# EAGLE design 0606_RGB_Clock_test (EAGLE 5.11)

## Sheet 1 of 3
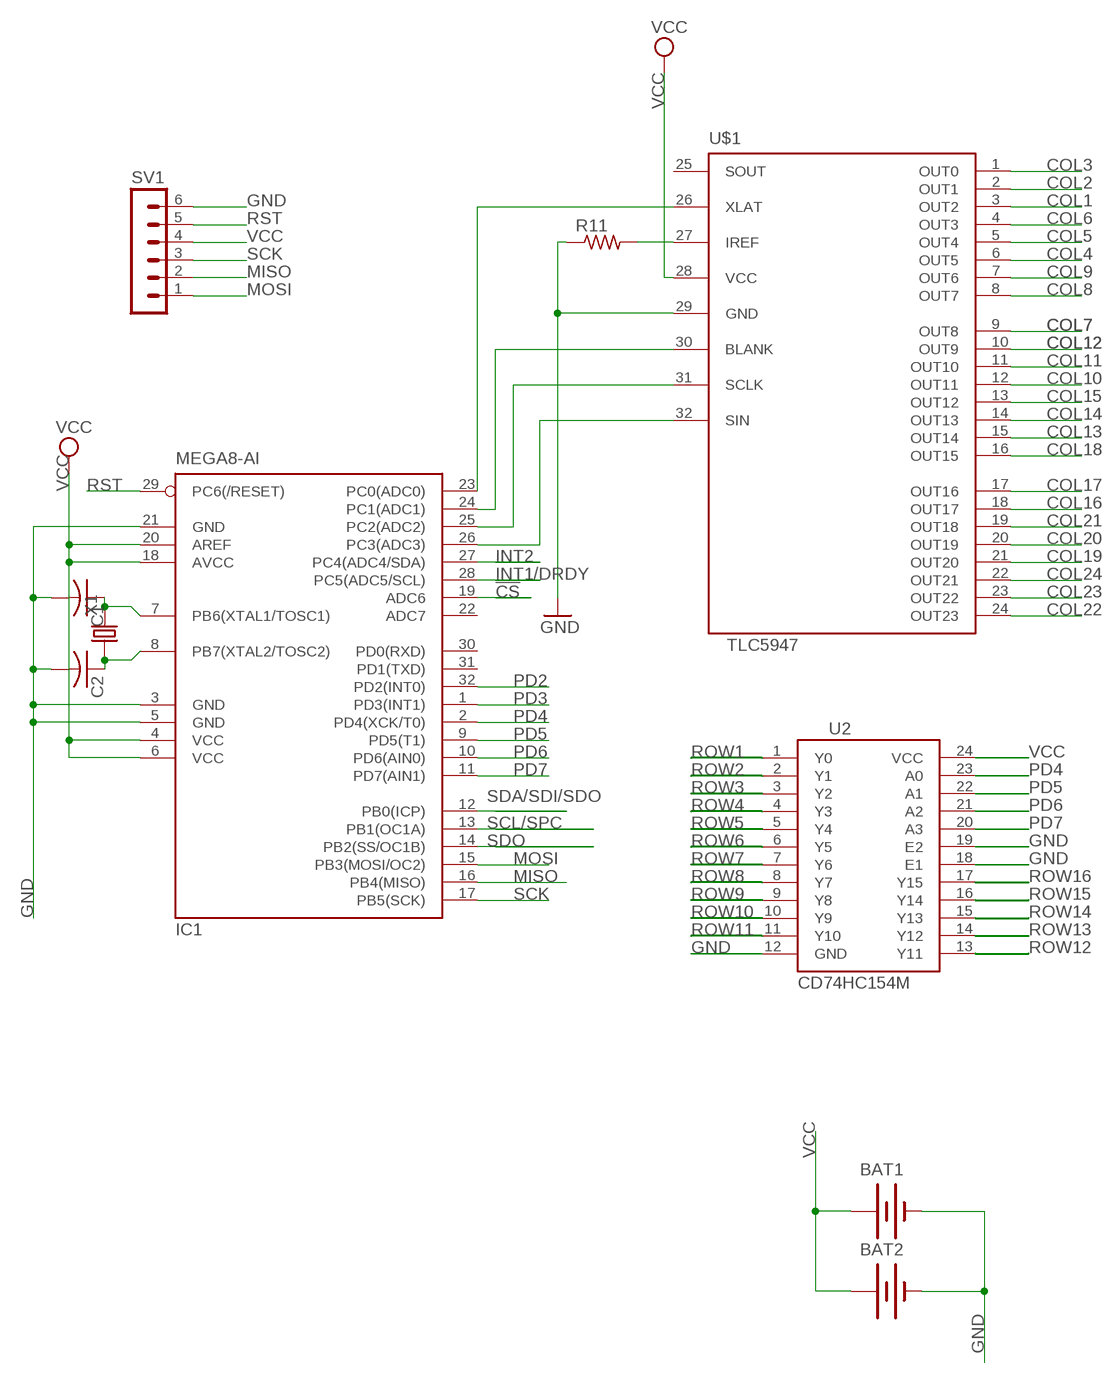
[diagram p0: schematic, sheet 1]

### Parts
BAT1  BATTERY20SMD  [BATTCON_20MM]
BAT2  BATTERY20SMD  [BATTCON_20MM]
C1  C-USC0805  [C0805]
C2  C-USC0805  [C0805]
IC1  MEGA8-AI  [TQFP32-08]
R11  R-US_R0805  [R0805]
SV1  MA06-1  [MA06-1]
U2  CD74HC154M  [SO-24DW]
U$1  TLC5947  [QFN32]
X1  CRYSTAL-5032  [5032]

### Nets
!CS: IC1.19(ADC6) ; also sheet 3
COL1: U$1.3(OUT2) ; also sheet 2
COL2: U$1.2(OUT1) ; also sheet 2
COL3: U$1.1(OUT0) ; also sheet 2
COL4: U$1.6(OUT5) ; also sheet 2
COL5: U$1.5(OUT4) ; also sheet 2
COL6: U$1.4(OUT3) ; also sheet 2
COL7: U$1.9(OUT8) ; also sheet 2
COL8: U$1.8(OUT7) ; also sheet 2
COL9: U$1.7(OUT6) ; also sheet 2
COL10: U$1.12(OUT11) ; also sheet 2
COL11: U$1.11(OUT10) ; also sheet 2
COL12: U$1.10(OUT9) ; also sheet 2
COL13: U$1.15(OUT14) ; also sheet 2
COL14: U$1.14(OUT13) ; also sheet 2
COL15: U$1.13(OUT12) ; also sheet 2
COL16: U$1.18(OUT17) ; also sheet 2
COL17: U$1.17(OUT16) ; also sheet 2
COL18: U$1.16(OUT15) ; also sheet 2
COL19: U$1.21(OUT20) ; also sheet 2
COL20: U$1.20(OUT19) ; also sheet 2
COL21: U$1.19(OUT18) ; also sheet 2
COL22: U$1.24(OUT23) ; also sheet 2
COL23: U$1.23(OUT22) ; also sheet 2
COL24: U$1.22(OUT21) ; also sheet 2
GND: BAT1.2(-) BAT2.2(-) C1.2 C2.2 IC1.3(GND) IC1.5(GND) IC1.21(GND) R11.1 SV1.6 U2.12(GND) U2.18(E1) U2.19(E2) U$1.29(GND) ; also sheet 3
INT1/DRDY: IC1.28(PC5(ADC5/SCL)) ; also sheet 3
INT2: IC1.27(PC4(ADC4/SDA)) ; also sheet 3
MISO: IC1.16(PB4(MISO)) SV1.2
MOSI: IC1.15(PB3(MOSI/OC2)) SV1.1
N$7: C1.1 IC1.7(PB6(XTAL1/TOSC1)) X1.2
N$8: C2.1 IC1.8(PB7(XTAL2/TOSC2)) X1.1
N$9: IC1.23(PC0(ADC0)) U$1.26(XLAT)
N$10: IC1.24(PC1(ADC1)) U$1.30(BLANK)
N$11: IC1.25(PC2(ADC2)) U$1.31(SCLK)
N$12: IC1.26(PC3(ADC3)) U$1.32(SIN)
N$13: R11.2 U$1.27(IREF)
PD2: IC1.32(PD2(INT0)) ; also sheet 3
PD3: IC1.1(PD3(INT1)) ; also sheet 3
PD4: IC1.2(PD4(XCK/T0)) U2.23(A0)
PD5: IC1.9(PD5(T1)) U2.22(A1)
PD6: IC1.10(PD6(AIN0)) U2.21(A2)
PD7: IC1.11(PD7(AIN1)) U2.20(A3)
ROW1: U2.1(Y0) ; also sheet 2
ROW2: U2.2(Y1) ; also sheet 2
ROW3: U2.3(Y2) ; also sheet 2
ROW4: U2.4(Y3) ; also sheet 2
ROW5: U2.5(Y4) ; also sheet 2
ROW6: U2.6(Y5) ; also sheet 2
ROW7: U2.7(Y6) ; also sheet 2
ROW8: U2.8(Y7) ; also sheet 2
ROW9: U2.9(Y8) ; also sheet 2
ROW10: U2.10(Y9)
ROW11: U2.11(Y10)
ROW12: U2.13(Y11)
ROW13: U2.14(Y12)
ROW14: U2.15(Y13)
ROW15: U2.16(Y14)
ROW16: U2.17(Y15)
RST: IC1.29(PC6(/RESET)) SV1.5
SCK: IC1.17(PB5(SCK)) SV1.3
SCL/SPC: IC1.13(PB1(OC1A)) ; also sheet 3
SDA/SDI/SDO: IC1.12(PB0(ICP)) ; also sheet 3
SDO: IC1.14(PB2(SS/OC1B)) ; also sheet 3
VCC: BAT1.1(+) BAT2.1(+) IC1.4(VCC) IC1.6(VCC) IC1.18(AVCC) IC1.20(AREF) SV1.4 U2.24(VCC) U$1.28(VCC) ; also sheet 2,3
Unconnected: IC1.22(ADC7) IC1.30(PD0(RXD)) IC1.31(PD1(TXD)) U$1.25(SOUT)

## Sheet 2 of 3
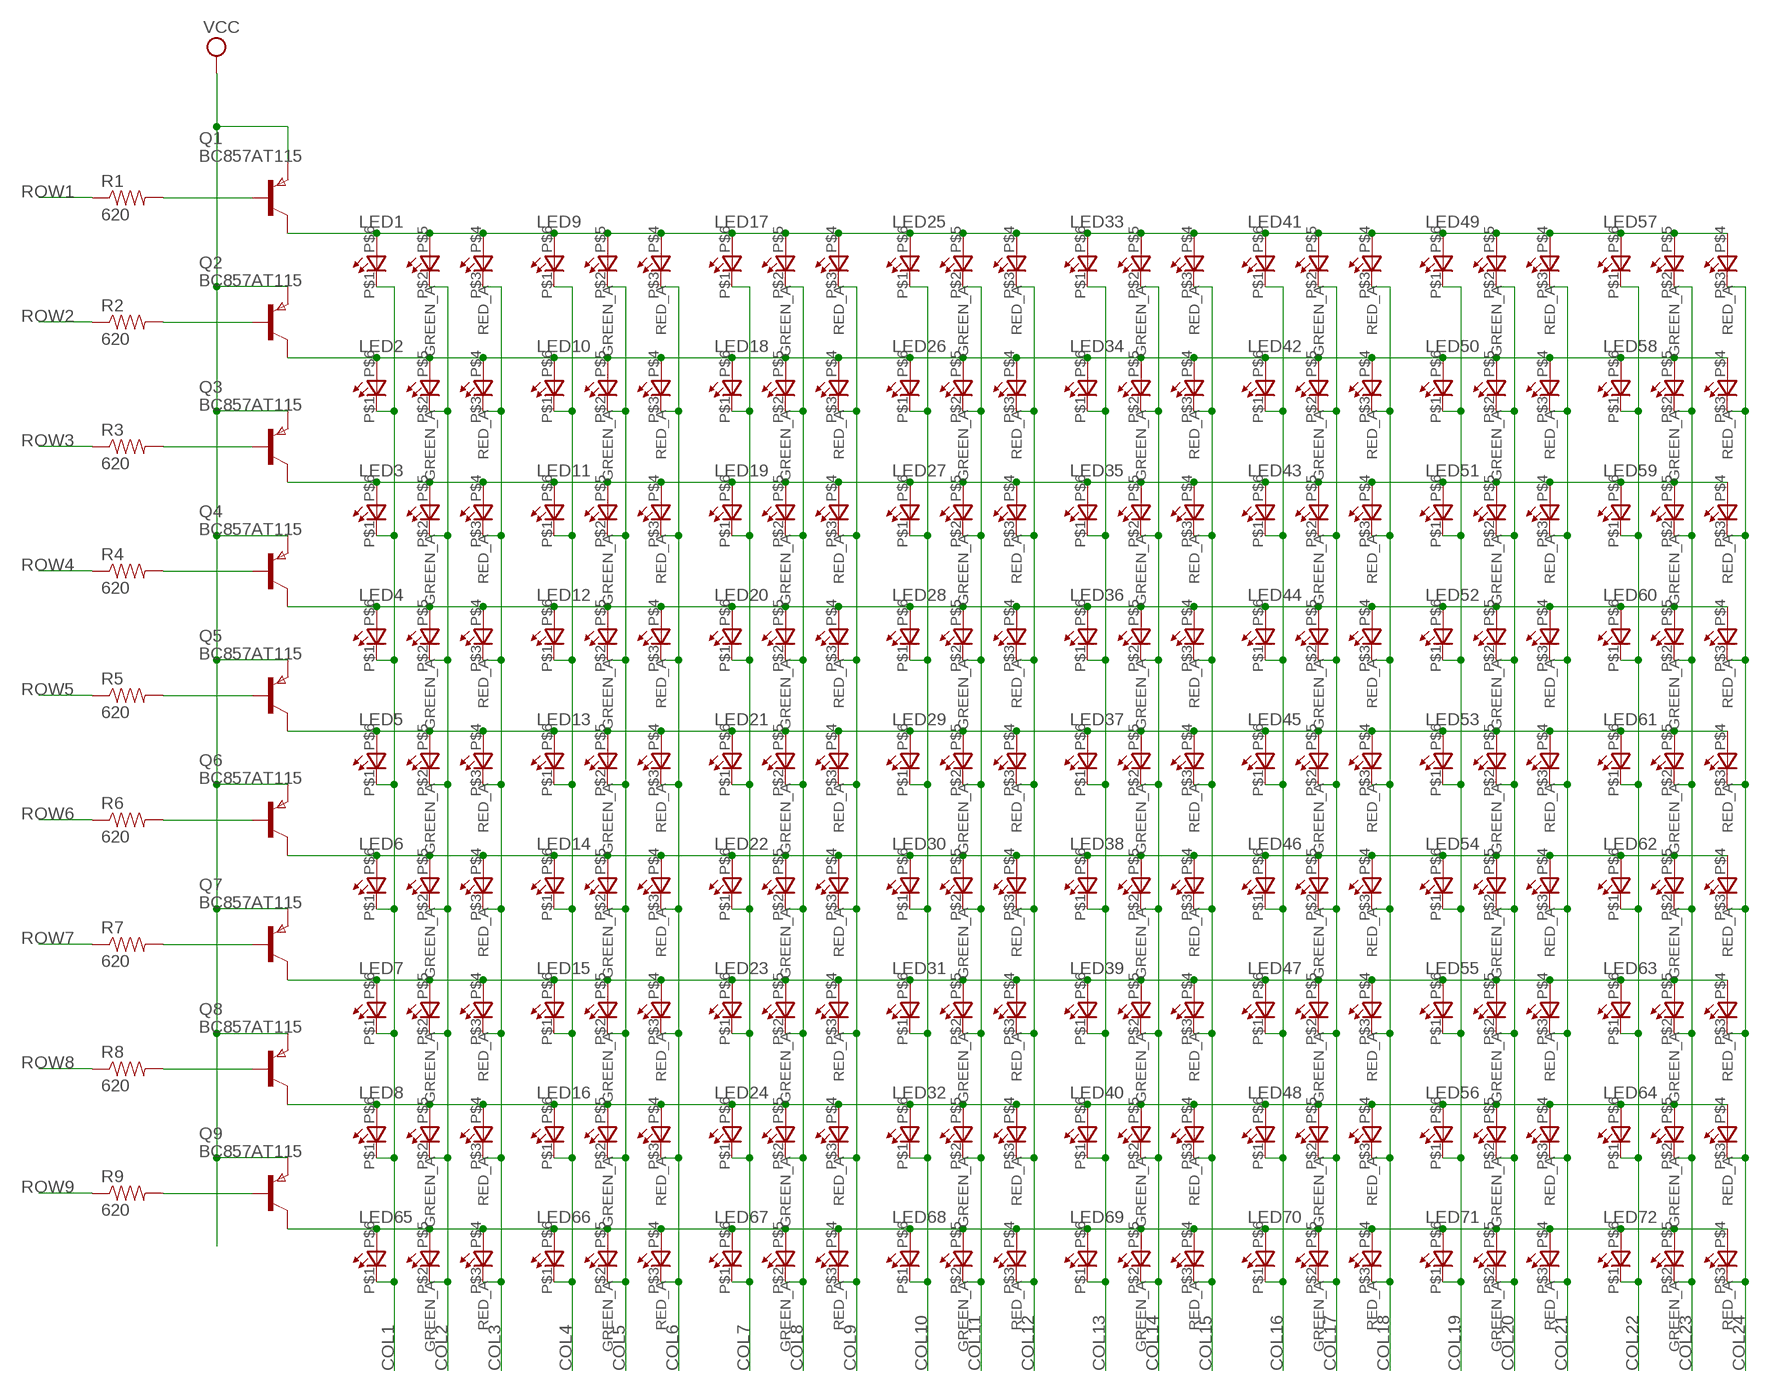
[diagram p1: schematic, sheet 2]

### Parts
LED1  0606_RGB_LED  [0606_LED]
LED2  0606_RGB_LED  [0606_LED]
LED3  0606_RGB_LED  [0606_LED]
LED4  0606_RGB_LED  [0606_LED]
LED5  0606_RGB_LED  [0606_LED]
LED6  0606_RGB_LED  [0606_LED]
LED7  0606_RGB_LED  [0606_LED]
LED8  0606_RGB_LED  [0606_LED]
LED9  0606_RGB_LED  [0606_LED]
LED10  0606_RGB_LED  [0606_LED]
LED11  0606_RGB_LED  [0606_LED]
LED12  0606_RGB_LED  [0606_LED]
LED13  0606_RGB_LED  [0606_LED]
LED14  0606_RGB_LED  [0606_LED]
LED15  0606_RGB_LED  [0606_LED]
LED16  0606_RGB_LED  [0606_LED]
LED17  0606_RGB_LED  [0606_LED]
LED18  0606_RGB_LED  [0606_LED]
LED19  0606_RGB_LED  [0606_LED]
LED20  0606_RGB_LED  [0606_LED]
LED21  0606_RGB_LED  [0606_LED]
LED22  0606_RGB_LED  [0606_LED]
LED23  0606_RGB_LED  [0606_LED]
LED24  0606_RGB_LED  [0606_LED]
LED25  0606_RGB_LED  [0606_LED]
LED26  0606_RGB_LED  [0606_LED]
LED27  0606_RGB_LED  [0606_LED]
LED28  0606_RGB_LED  [0606_LED]
LED29  0606_RGB_LED  [0606_LED]
LED30  0606_RGB_LED  [0606_LED]
LED31  0606_RGB_LED  [0606_LED]
LED32  0606_RGB_LED  [0606_LED]
LED33  0606_RGB_LED  [0606_LED]
LED34  0606_RGB_LED  [0606_LED]
LED35  0606_RGB_LED  [0606_LED]
LED36  0606_RGB_LED  [0606_LED]
LED37  0606_RGB_LED  [0606_LED]
LED38  0606_RGB_LED  [0606_LED]
LED39  0606_RGB_LED  [0606_LED]
LED40  0606_RGB_LED  [0606_LED]
LED41  0606_RGB_LED  [0606_LED]
LED42  0606_RGB_LED  [0606_LED]
LED43  0606_RGB_LED  [0606_LED]
LED44  0606_RGB_LED  [0606_LED]
LED45  0606_RGB_LED  [0606_LED]
LED46  0606_RGB_LED  [0606_LED]
LED47  0606_RGB_LED  [0606_LED]
LED48  0606_RGB_LED  [0606_LED]
LED49  0606_RGB_LED  [0606_LED]
LED50  0606_RGB_LED  [0606_LED]
LED51  0606_RGB_LED  [0606_LED]
LED52  0606_RGB_LED  [0606_LED]
LED53  0606_RGB_LED  [0606_LED]
LED54  0606_RGB_LED  [0606_LED]
LED55  0606_RGB_LED  [0606_LED]
LED56  0606_RGB_LED  [0606_LED]
LED57  0606_RGB_LED  [0606_LED]
LED58  0606_RGB_LED  [0606_LED]
LED59  0606_RGB_LED  [0606_LED]
LED60  0606_RGB_LED  [0606_LED]
LED61  0606_RGB_LED  [0606_LED]
LED62  0606_RGB_LED  [0606_LED]
LED63  0606_RGB_LED  [0606_LED]
LED64  0606_RGB_LED  [0606_LED]
LED65  0606_RGB_LED  [0606_LED]
LED66  0606_RGB_LED  [0606_LED]
LED67  0606_RGB_LED  [0606_LED]
LED68  0606_RGB_LED  [0606_LED]
LED69  0606_RGB_LED  [0606_LED]
LED70  0606_RGB_LED  [0606_LED]
LED71  0606_RGB_LED  [0606_LED]
LED72  0606_RGB_LED  [0606_LED]
Q1  BC857AT115  PNPSOT323SOT416  [SOT416]
Q2  BC857AT115  PNPSOT323SOT416  [SOT416]
Q3  BC857AT115  PNPSOT323SOT416  [SOT416]
Q4  BC857AT115  PNPSOT323SOT416  [SOT416]
Q5  BC857AT115  PNPSOT323SOT416  [SOT416]
Q6  BC857AT115  PNPSOT323SOT416  [SOT416]
Q7  BC857AT115  PNPSOT323SOT416  [SOT416]
Q8  BC857AT115  PNPSOT323SOT416  [SOT416]
Q9  BC857AT115  PNPSOT323SOT416  [SOT416]
R1  620  SPARKFUN_RESISTOR0603-RES  [SPARKFUN_0603-RES]
R2  620  SPARKFUN_RESISTOR0603-RES  [SPARKFUN_0603-RES]
R3  620  SPARKFUN_RESISTOR0603-RES  [SPARKFUN_0603-RES]
R4  620  SPARKFUN_RESISTOR0603-RES  [SPARKFUN_0603-RES]
R5  620  SPARKFUN_RESISTOR0603-RES  [SPARKFUN_0603-RES]
R6  620  SPARKFUN_RESISTOR0603-RES  [SPARKFUN_0603-RES]
R7  620  SPARKFUN_RESISTOR0603-RES  [SPARKFUN_0603-RES]
R8  620  SPARKFUN_RESISTOR0603-RES  [SPARKFUN_0603-RES]
R9  620  SPARKFUN_RESISTOR0603-RES  [SPARKFUN_0603-RES]

### Nets
COL1: LED1.P$1(C_BLUE) LED2.P$1(C_BLUE) LED3.P$1(C_BLUE) LED4.P$1(C_BLUE) LED5.P$1(C_BLUE) LED6.P$1(C_BLUE) LED7.P$1(C_BLUE) LED8.P$1(C_BLUE) LED65.P$1(C_BLUE) ; also sheet 1
COL2: LED1.P$2(C_GREEN) LED2.P$2(C_GREEN) LED3.P$2(C_GREEN) LED4.P$2(C_GREEN) LED5.P$2(C_GREEN) LED6.P$2(C_GREEN) LED7.P$2(C_GREEN) LED8.P$2(C_GREEN) LED65.P$2(C_GREEN) ; also sheet 1
COL3: LED1.P$3(C_RED) LED2.P$3(C_RED) LED3.P$3(C_RED) LED4.P$3(C_RED) LED5.P$3(C_RED) LED6.P$3(C_RED) LED7.P$3(C_RED) LED8.P$3(C_RED) LED65.P$3(C_RED) ; also sheet 1
COL4: LED9.P$1(C_BLUE) LED10.P$1(C_BLUE) LED11.P$1(C_BLUE) LED12.P$1(C_BLUE) LED13.P$1(C_BLUE) LED14.P$1(C_BLUE) LED15.P$1(C_BLUE) LED16.P$1(C_BLUE) LED66.P$1(C_BLUE) ; also sheet 1
COL5: LED9.P$2(C_GREEN) LED10.P$2(C_GREEN) LED11.P$2(C_GREEN) LED12.P$2(C_GREEN) LED13.P$2(C_GREEN) LED14.P$2(C_GREEN) LED15.P$2(C_GREEN) LED16.P$2(C_GREEN) LED66.P$2(C_GREEN) ; also sheet 1
COL6: LED9.P$3(C_RED) LED10.P$3(C_RED) LED11.P$3(C_RED) LED12.P$3(C_RED) LED13.P$3(C_RED) LED14.P$3(C_RED) LED15.P$3(C_RED) LED16.P$3(C_RED) LED66.P$3(C_RED) ; also sheet 1
COL7: LED17.P$1(C_BLUE) LED18.P$1(C_BLUE) LED19.P$1(C_BLUE) LED20.P$1(C_BLUE) LED21.P$1(C_BLUE) LED22.P$1(C_BLUE) LED23.P$1(C_BLUE) LED24.P$1(C_BLUE) LED67.P$1(C_BLUE) ; also sheet 1
COL8: LED17.P$2(C_GREEN) LED18.P$2(C_GREEN) LED19.P$2(C_GREEN) LED20.P$2(C_GREEN) LED21.P$2(C_GREEN) LED22.P$2(C_GREEN) LED23.P$2(C_GREEN) LED24.P$2(C_GREEN) LED67.P$2(C_GREEN) ; also sheet 1
COL9: LED17.P$3(C_RED) LED18.P$3(C_RED) LED19.P$3(C_RED) LED20.P$3(C_RED) LED21.P$3(C_RED) LED22.P$3(C_RED) LED23.P$3(C_RED) LED24.P$3(C_RED) LED67.P$3(C_RED) ; also sheet 1
COL10: LED25.P$1(C_BLUE) LED26.P$1(C_BLUE) LED27.P$1(C_BLUE) LED28.P$1(C_BLUE) LED29.P$1(C_BLUE) LED30.P$1(C_BLUE) LED31.P$1(C_BLUE) LED32.P$1(C_BLUE) LED68.P$1(C_BLUE) ; also sheet 1
COL11: LED25.P$2(C_GREEN) LED26.P$2(C_GREEN) LED27.P$2(C_GREEN) LED28.P$2(C_GREEN) LED29.P$2(C_GREEN) LED30.P$2(C_GREEN) LED31.P$2(C_GREEN) LED32.P$2(C_GREEN) LED68.P$2(C_GREEN) ; also sheet 1
COL12: LED25.P$3(C_RED) LED26.P$3(C_RED) LED27.P$3(C_RED) LED28.P$3(C_RED) LED29.P$3(C_RED) LED30.P$3(C_RED) LED31.P$3(C_RED) LED32.P$3(C_RED) LED68.P$3(C_RED) ; also sheet 1
COL13: LED33.P$1(C_BLUE) LED34.P$1(C_BLUE) LED35.P$1(C_BLUE) LED36.P$1(C_BLUE) LED37.P$1(C_BLUE) LED38.P$1(C_BLUE) LED39.P$1(C_BLUE) LED40.P$1(C_BLUE) LED69.P$1(C_BLUE) ; also sheet 1
COL14: LED33.P$2(C_GREEN) LED34.P$2(C_GREEN) LED35.P$2(C_GREEN) LED36.P$2(C_GREEN) LED37.P$2(C_GREEN) LED38.P$2(C_GREEN) LED39.P$2(C_GREEN) LED40.P$2(C_GREEN) LED69.P$2(C_GREEN) ; also sheet 1
COL15: LED33.P$3(C_RED) LED34.P$3(C_RED) LED35.P$3(C_RED) LED36.P$3(C_RED) LED37.P$3(C_RED) LED38.P$3(C_RED) LED39.P$3(C_RED) LED40.P$3(C_RED) LED69.P$3(C_RED) ; also sheet 1
COL16: LED41.P$1(C_BLUE) LED42.P$1(C_BLUE) LED43.P$1(C_BLUE) LED44.P$1(C_BLUE) LED45.P$1(C_BLUE) LED46.P$1(C_BLUE) LED47.P$1(C_BLUE) LED48.P$1(C_BLUE) LED70.P$1(C_BLUE) ; also sheet 1
COL17: LED41.P$2(C_GREEN) LED42.P$2(C_GREEN) LED43.P$2(C_GREEN) LED44.P$2(C_GREEN) LED45.P$2(C_GREEN) LED46.P$2(C_GREEN) LED47.P$2(C_GREEN) LED48.P$2(C_GREEN) LED70.P$2(C_GREEN) ; also sheet 1
COL18: LED41.P$3(C_RED) LED42.P$3(C_RED) LED43.P$3(C_RED) LED44.P$3(C_RED) LED45.P$3(C_RED) LED46.P$3(C_RED) LED47.P$3(C_RED) LED48.P$3(C_RED) LED70.P$3(C_RED) ; also sheet 1
COL19: LED49.P$1(C_BLUE) LED50.P$1(C_BLUE) LED51.P$1(C_BLUE) LED52.P$1(C_BLUE) LED53.P$1(C_BLUE) LED54.P$1(C_BLUE) LED55.P$1(C_BLUE) LED56.P$1(C_BLUE) LED71.P$1(C_BLUE) ; also sheet 1
COL20: LED49.P$2(C_GREEN) LED50.P$2(C_GREEN) LED51.P$2(C_GREEN) LED52.P$2(C_GREEN) LED53.P$2(C_GREEN) LED54.P$2(C_GREEN) LED55.P$2(C_GREEN) LED56.P$2(C_GREEN) LED71.P$2(C_GREEN) ; also sheet 1
COL21: LED49.P$3(C_RED) LED50.P$3(C_RED) LED51.P$3(C_RED) LED52.P$3(C_RED) LED53.P$3(C_RED) LED54.P$3(C_RED) LED55.P$3(C_RED) LED56.P$3(C_RED) LED71.P$3(C_RED) ; also sheet 1
COL22: LED57.P$1(C_BLUE) LED58.P$1(C_BLUE) LED59.P$1(C_BLUE) LED60.P$1(C_BLUE) LED61.P$1(C_BLUE) LED62.P$1(C_BLUE) LED63.P$1(C_BLUE) LED64.P$1(C_BLUE) LED72.P$1(C_BLUE) ; also sheet 1
COL23: LED57.P$2(C_GREEN) LED58.P$2(C_GREEN) LED59.P$2(C_GREEN) LED60.P$2(C_GREEN) LED61.P$2(C_GREEN) LED62.P$2(C_GREEN) LED63.P$2(C_GREEN) LED64.P$2(C_GREEN) LED72.P$2(C_GREEN) ; also sheet 1
COL24: LED57.P$3(C_RED) LED58.P$3(C_RED) LED59.P$3(C_RED) LED60.P$3(C_RED) LED61.P$3(C_RED) LED62.P$3(C_RED) LED63.P$3(C_RED) LED64.P$3(C_RED) LED72.P$3(C_RED) ; also sheet 1
LINE1: LED1.P$4(RED_A) LED1.P$5(GREEN_A) LED1.P$6(BLUE_A) LED9.P$4(RED_A) LED9.P$5(GREEN_A) LED9.P$6(BLUE_A) LED17.P$4(RED_A) LED17.P$5(GREEN_A) LED17.P$6(BLUE_A) LED25.P$4(RED_A) LED25.P$5(GREEN_A) LED25.P$6(BLUE_A) LED33.P$4(RED_A) LED33.P$5(GREEN_A) LED33.P$6(BLUE_A) LED41.P$4(RED_A) LED41.P$5(GREEN_A) LED41.P$6(BLUE_A) LED49.P$4(RED_A) LED49.P$5(GREEN_A) LED49.P$6(BLUE_A) LED57.P$4(RED_A) LED57.P$5(GREEN_A) LED57.P$6(BLUE_A) Q1.1(C)
LINE2: LED2.P$4(RED_A) LED2.P$5(GREEN_A) LED2.P$6(BLUE_A) LED10.P$4(RED_A) LED10.P$5(GREEN_A) LED10.P$6(BLUE_A) LED18.P$4(RED_A) LED18.P$5(GREEN_A) LED18.P$6(BLUE_A) LED26.P$4(RED_A) LED26.P$5(GREEN_A) LED26.P$6(BLUE_A) LED34.P$4(RED_A) LED34.P$5(GREEN_A) LED34.P$6(BLUE_A) LED42.P$4(RED_A) LED42.P$5(GREEN_A) LED42.P$6(BLUE_A) LED50.P$4(RED_A) LED50.P$5(GREEN_A) LED50.P$6(BLUE_A) LED58.P$4(RED_A) LED58.P$5(GREEN_A) LED58.P$6(BLUE_A) Q2.1(C)
LINE3: LED3.P$4(RED_A) LED3.P$5(GREEN_A) LED3.P$6(BLUE_A) LED11.P$4(RED_A) LED11.P$5(GREEN_A) LED11.P$6(BLUE_A) LED19.P$4(RED_A) LED19.P$5(GREEN_A) LED19.P$6(BLUE_A) LED27.P$4(RED_A) LED27.P$5(GREEN_A) LED27.P$6(BLUE_A) LED35.P$4(RED_A) LED35.P$5(GREEN_A) LED35.P$6(BLUE_A) LED43.P$4(RED_A) LED43.P$5(GREEN_A) LED43.P$6(BLUE_A) LED51.P$4(RED_A) LED51.P$5(GREEN_A) LED51.P$6(BLUE_A) LED59.P$4(RED_A) LED59.P$5(GREEN_A) LED59.P$6(BLUE_A) Q3.1(C)
LINE4: LED4.P$4(RED_A) LED4.P$5(GREEN_A) LED4.P$6(BLUE_A) LED12.P$4(RED_A) LED12.P$5(GREEN_A) LED12.P$6(BLUE_A) LED20.P$4(RED_A) LED20.P$5(GREEN_A) LED20.P$6(BLUE_A) LED28.P$4(RED_A) LED28.P$5(GREEN_A) LED28.P$6(BLUE_A) LED36.P$4(RED_A) LED36.P$5(GREEN_A) LED36.P$6(BLUE_A) LED44.P$4(RED_A) LED44.P$5(GREEN_A) LED44.P$6(BLUE_A) LED52.P$4(RED_A) LED52.P$5(GREEN_A) LED52.P$6(BLUE_A) LED60.P$4(RED_A) LED60.P$5(GREEN_A) LED60.P$6(BLUE_A) Q4.1(C)
LINE5: LED5.P$4(RED_A) LED5.P$5(GREEN_A) LED5.P$6(BLUE_A) LED13.P$4(RED_A) LED13.P$5(GREEN_A) LED13.P$6(BLUE_A) LED21.P$4(RED_A) LED21.P$5(GREEN_A) LED21.P$6(BLUE_A) LED29.P$4(RED_A) LED29.P$5(GREEN_A) LED29.P$6(BLUE_A) LED37.P$4(RED_A) LED37.P$5(GREEN_A) LED37.P$6(BLUE_A) LED45.P$4(RED_A) LED45.P$5(GREEN_A) LED45.P$6(BLUE_A) LED53.P$4(RED_A) LED53.P$5(GREEN_A) LED53.P$6(BLUE_A) LED61.P$4(RED_A) LED61.P$5(GREEN_A) LED61.P$6(BLUE_A) Q5.1(C)
LINE6: LED6.P$4(RED_A) LED6.P$5(GREEN_A) LED6.P$6(BLUE_A) LED14.P$4(RED_A) LED14.P$5(GREEN_A) LED14.P$6(BLUE_A) LED22.P$4(RED_A) LED22.P$5(GREEN_A) LED22.P$6(BLUE_A) LED30.P$4(RED_A) LED30.P$5(GREEN_A) LED30.P$6(BLUE_A) LED38.P$4(RED_A) LED38.P$5(GREEN_A) LED38.P$6(BLUE_A) LED46.P$4(RED_A) LED46.P$5(GREEN_A) LED46.P$6(BLUE_A) LED54.P$4(RED_A) LED54.P$5(GREEN_A) LED54.P$6(BLUE_A) LED62.P$4(RED_A) LED62.P$5(GREEN_A) LED62.P$6(BLUE_A) Q6.1(C)
LINE7: LED7.P$4(RED_A) LED7.P$5(GREEN_A) LED7.P$6(BLUE_A) LED15.P$4(RED_A) LED15.P$5(GREEN_A) LED15.P$6(BLUE_A) LED23.P$4(RED_A) LED23.P$5(GREEN_A) LED23.P$6(BLUE_A) LED31.P$4(RED_A) LED31.P$5(GREEN_A) LED31.P$6(BLUE_A) LED39.P$4(RED_A) LED39.P$5(GREEN_A) LED39.P$6(BLUE_A) LED47.P$4(RED_A) LED47.P$5(GREEN_A) LED47.P$6(BLUE_A) LED55.P$4(RED_A) LED55.P$5(GREEN_A) LED55.P$6(BLUE_A) LED63.P$4(RED_A) LED63.P$5(GREEN_A) LED63.P$6(BLUE_A) Q7.1(C)
LINE8: LED8.P$4(RED_A) LED8.P$5(GREEN_A) LED8.P$6(BLUE_A) LED16.P$4(RED_A) LED16.P$5(GREEN_A) LED16.P$6(BLUE_A) LED24.P$4(RED_A) LED24.P$5(GREEN_A) LED24.P$6(BLUE_A) LED32.P$4(RED_A) LED32.P$5(GREEN_A) LED32.P$6(BLUE_A) LED40.P$4(RED_A) LED40.P$5(GREEN_A) LED40.P$6(BLUE_A) LED48.P$4(RED_A) LED48.P$5(GREEN_A) LED48.P$6(BLUE_A) LED56.P$4(RED_A) LED56.P$5(GREEN_A) LED56.P$6(BLUE_A) LED64.P$4(RED_A) LED64.P$5(GREEN_A) LED64.P$6(BLUE_A) Q8.1(C)
LINE9: LED65.P$4(RED_A) LED65.P$5(GREEN_A) LED65.P$6(BLUE_A) LED66.P$4(RED_A) LED66.P$5(GREEN_A) LED66.P$6(BLUE_A) LED67.P$4(RED_A) LED67.P$5(GREEN_A) LED67.P$6(BLUE_A) LED68.P$4(RED_A) LED68.P$5(GREEN_A) LED68.P$6(BLUE_A) LED69.P$4(RED_A) LED69.P$5(GREEN_A) LED69.P$6(BLUE_A) LED70.P$4(RED_A) LED70.P$5(GREEN_A) LED70.P$6(BLUE_A) LED71.P$4(RED_A) LED71.P$5(GREEN_A) LED71.P$6(BLUE_A) LED72.P$4(RED_A) LED72.P$5(GREEN_A) LED72.P$6(BLUE_A) Q9.1(C)
N$2: Q1.2(B) R1.2
N$34: Q2.2(B) R2.2
N$59: Q3.2(B) R3.2
N$60: Q6.2(B) R6.2
N$61: Q7.2(B) R7.2
N$62: Q8.2(B) R8.2
N$63: Q5.2(B) R5.2
N$84: Q4.2(B) R4.2
N$89: Q9.2(B) R9.2
ROW1: R1.1 ; also sheet 1
ROW2: R2.1 ; also sheet 1
ROW3: R3.1 ; also sheet 1
ROW4: R4.1 ; also sheet 1
ROW5: R5.1 ; also sheet 1
ROW6: R6.1 ; also sheet 1
ROW7: R7.1 ; also sheet 1
ROW8: R8.1 ; also sheet 1
ROW9: R9.1 ; also sheet 1
VCC: Q1.3(E) Q2.3(E) Q3.3(E) Q4.3(E) Q5.3(E) Q6.3(E) Q7.3(E) Q8.3(E) Q9.3(E) ; also sheet 1,3

## Sheet 3 of 3
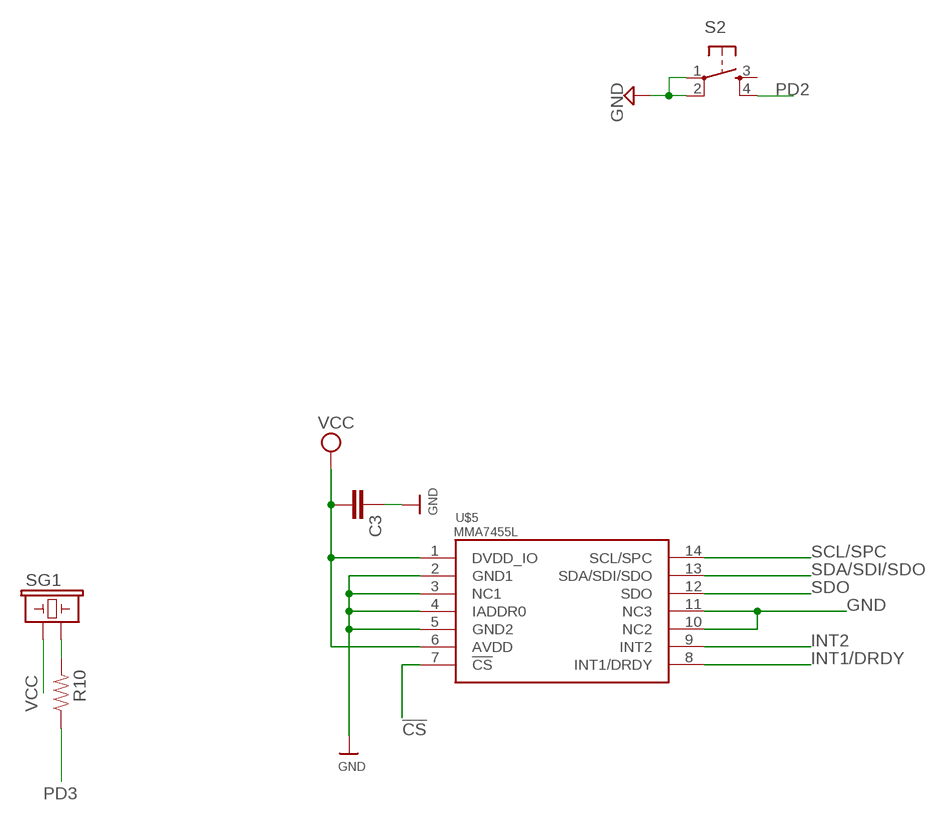
[diagram p2: schematic, sheet 3]

### Parts
C3  CAP0805  [0805]
R10  RESISTOR1206  [1206]
S2  TAC_SWITCHSMD  [TACTILE_SWITCH_SMD]
SG1  BUZZERSMD2  [BUZZER-CCV]
U$5  MMA7455L  [LGA-14]

### Nets
!CS: U$5.7(!CS) ; also sheet 1
GND: C3.1 S2.1 S2.2 U$5.2(GND1) U$5.3(NC1) U$5.4(IADDR0) U$5.5(GND2) U$5.10(NC2) U$5.11(NC3) ; also sheet 1
INT1/DRDY: U$5.8(INT1/DRDY) ; also sheet 1
INT2: U$5.9(INT2) ; also sheet 1
N$5: R10.2 SG1.-
PD2: S2.4 ; also sheet 1
PD3: R10.1 ; also sheet 1
SCL/SPC: U$5.14(SCL/SPC) ; also sheet 1
SDA/SDI/SDO: U$5.13(SDA/SDI/SDO) ; also sheet 1
SDO: U$5.12(SDO) ; also sheet 1
VCC: C3.2 SG1.+ U$5.1(DVDD_IO) U$5.6(AVDD) ; also sheet 1,2
Unconnected: S2.3

## Library data of the parts
BAT1 BAT2 = SparkFun:BATTERY: Battery Holders Various common sizes : AA, AAA, 20mm coin cell and 12mm coin cell.
C1 C2 = rcl:C-US: CAPACITOR, American symbol
C3 = SparkFun:CAP: Capacitor Standard 0603 ceramic capacitor, and 0.1" leaded capacitor.
IC1 = atmel:MEGA8: MICROCONTROLLER 8 Kbytes FLASH, 1 kbytes SRAM, 512 bytes EEPROM, USART, 6-channel 10 bit ADC, 2-channel 8 bit ADC Pin compatible with Atmega48, ATMega88, ATMega168 Source: avr.lbr
LED1-LED72 = lil_rgb:0606_RGB_LED
Q1-Q9 = zetex:PNPSOT323: PNP TRANSISTOR
R1-R9 = Nullspace:SPARKFUN_RESISTOR: Resistor Basic schematic elements and footprints for 0603, 1206, and PTH 1/10th watt (small) resistors.
R10 = SparkFun:RESISTOR: Resistor Basic schematic elements and footprints for 0603, 1206, and PTH resistors.
R11 = rcl:R-US_: RESISTOR, American symbol
S2 = SparkFun:TAC_SWITCH: Momentary Switch Button commonly used for reset or general input. Spark Fun Electronics SKU : COM-00097
SG1 = SparkFun:BUZZER: Buzzer 12mm Spark Fun Electronics SKU : Comp-Buzzer
SV1 = NSL:MA06-1: PIN HEADER
U2 = SparkFun:CD74HC154M: High-Speed CMOS Logic 4- to 16-Line Decoder/Demultiplexer
U$1 = lil_rgb:TLC5947
U$5 = MMA7455Lbreakoutboard-v1a:MMA7455L
X1 = NSL_MiniQuad:CRYSTAL*: CRYSTAL

## Net classes
0 default: width 0.254 mm

## Board
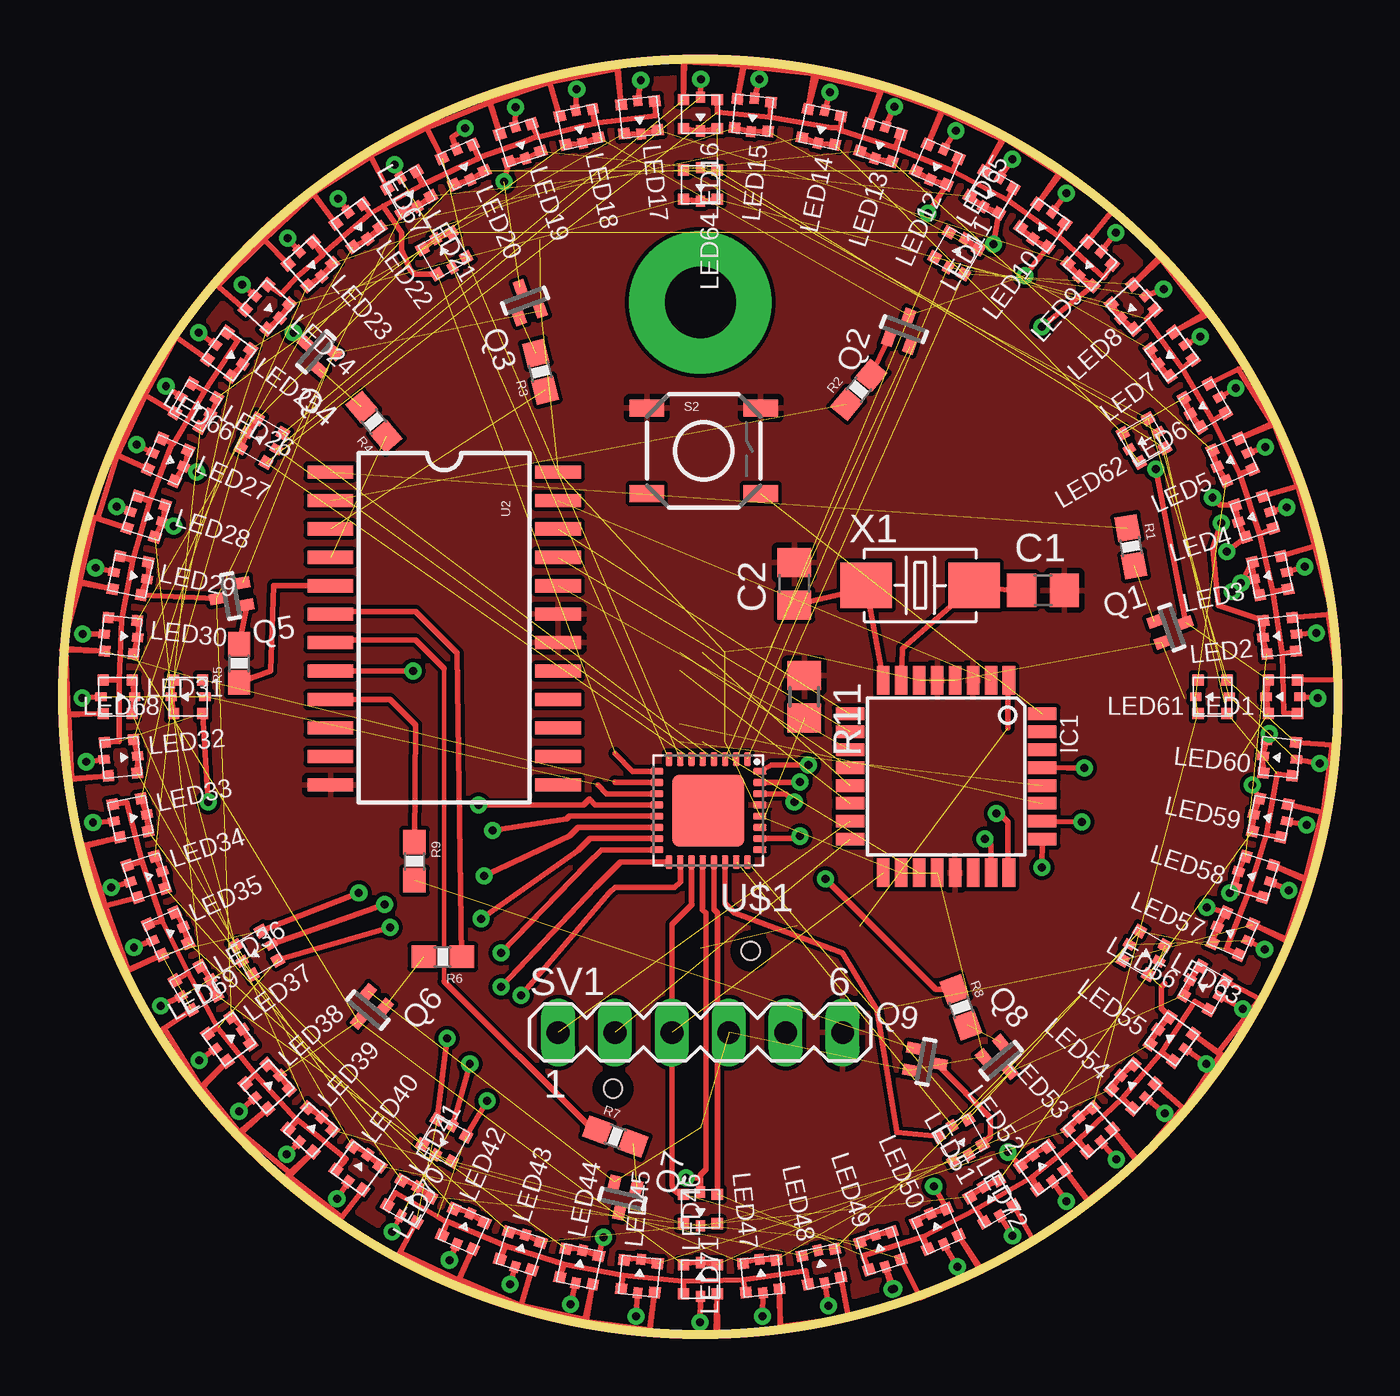
[diagram p3: board, top side]
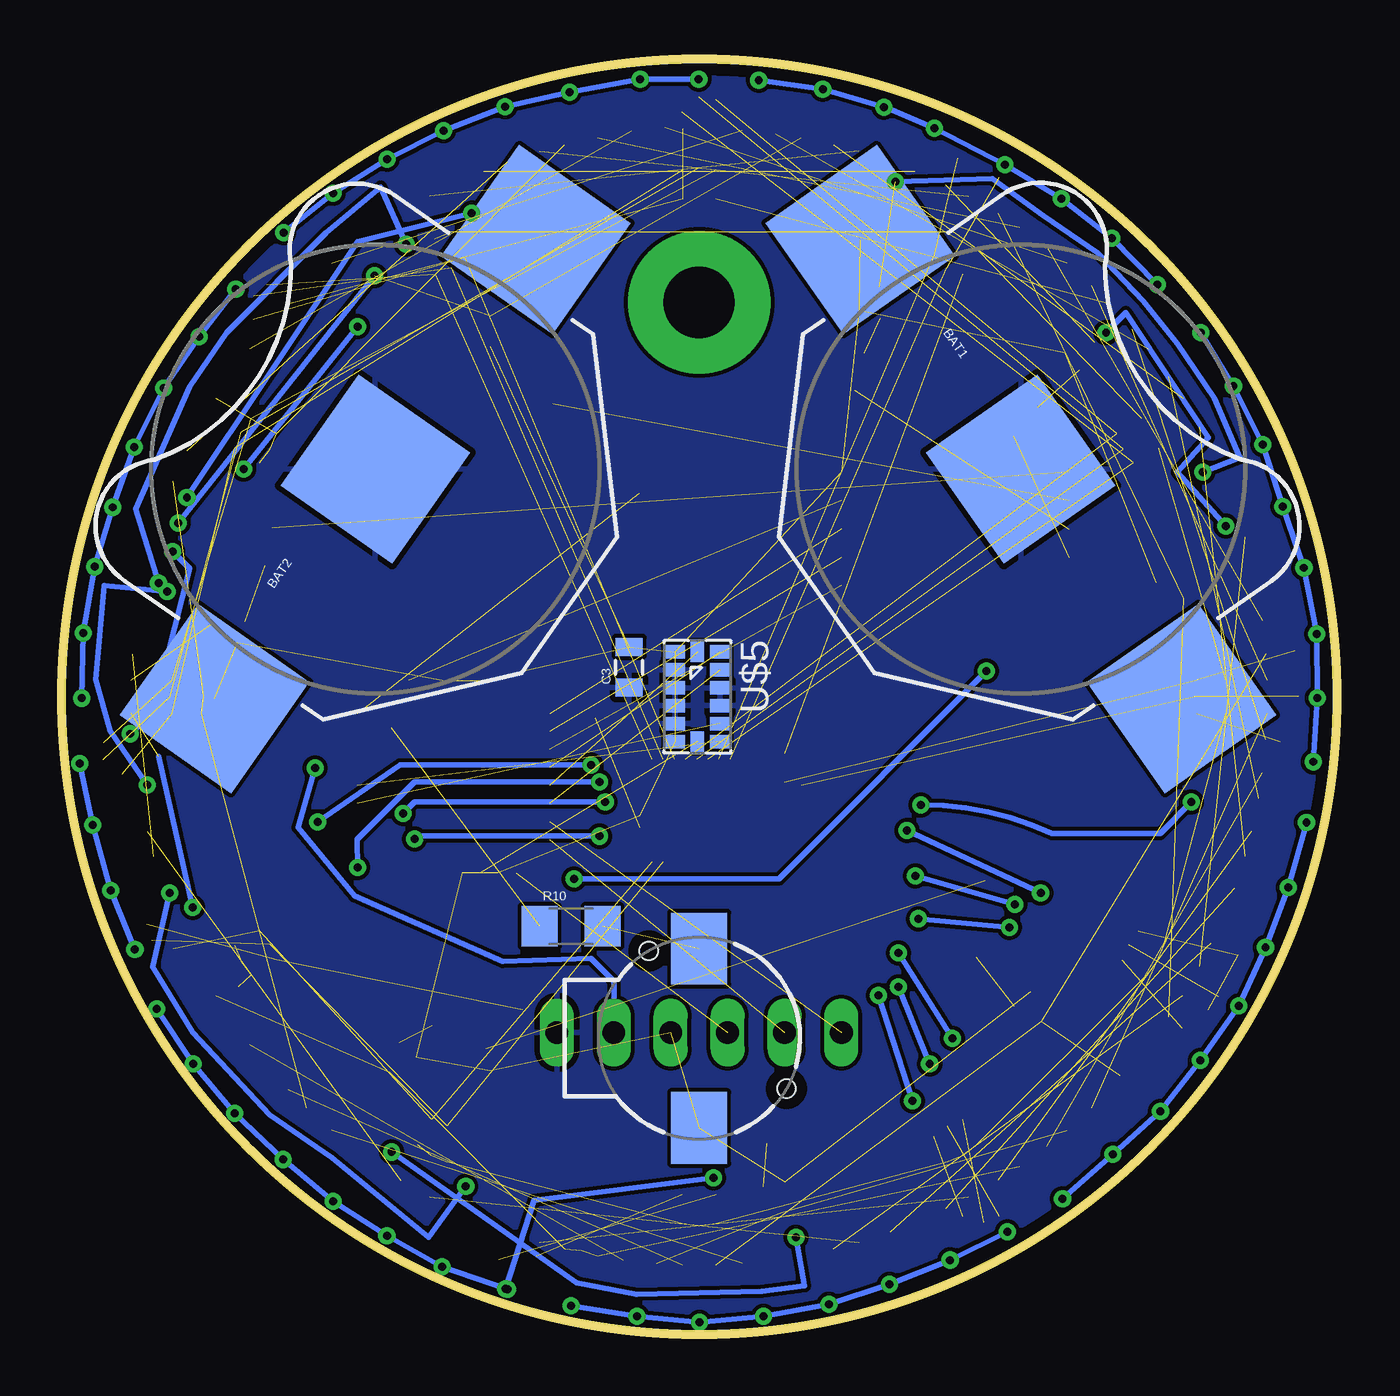
[diagram p4: board, bottom side, seen from below]

Size 56.9 x 56.9 mm. Coordinates in mm from the lower left corner, seen from the top.
Outline: circle at 28.45,28.45 radius 28.45
Copper layers (1*16): Top 0.0356mm / dielectric 1.5011mm / Bottom 0.0356mm
Design rules "SilverCircuits": minimum track width 7mil, minimum drill 14mil, track to track 7mil, track to pad 7mil, pad to pad 7mil, via to via 7mil, smd to smd 0mil, copper to edge 20mil, drill to drill 8mil, minimum pad ring 10mil, minimum via ring 8mil, stop-mask expansion 4mil, vias tented up to drill 0mil, thermal gap 10mil

### Footprints (pad centres in the part's own frame; a part is rotated, then mirrored left to right if it is on the bottom)
BATTCON_20MM = smd 6.07 x 6.07: 1 -12.5,0; 2 0,0; 3 12.5,0
C0805 = smd 1.3 x 1.5: 1 -0.95,0; 2 0.95,0
0805 = smd 0.8 x 1.2: 1 -0.9,0; 2 0.9,0
TQFP32-08 = smd 1.27 x 0.559: 1 -4.293,2.8; 2 -4.293,2; 3 -4.293,1.2; 4 -4.293,0.4; 5 -4.293,-0.4; 6 -4.293,-1.2; 7 -4.293,-2; 8 -4.293,-2.8; 17 4.293,-2.8; 18 4.293,-2; 19 4.293,-1.2; 20 4.293,-0.4; 21 4.293,0.4; 22 4.293,1.2; 23 4.293,2; 24 4.293,2.8 | smd 0.559 x 1.27: 9 -2.8,-4.293; 10 -2,-4.293; 11 -1.2,-4.293; 12 -0.4,-4.293; 13 0.4,-4.293; 14 1.2,-4.293; 15 2,-4.293; 16 2.8,-4.293; 25 2.8,4.293; 26 2,4.293; 27 1.2,4.293; 28 0.4,4.293; 29 -0.4,4.293; 30 -1.2,4.293; 31 -2,4.293; 32 -2.8,4.293
0606_LED = smd 0.5 x 0.5: P$1 -0.75,-0.65; P$3 0.75,-0.65; P$4 0.75,0.65; P$6 -0.75,0.65 | smd 0.4 x 0.5: P$2 0,-0.75; P$5 0,0.75
SOT416 = smd 0.6 x 0.5: 1 -0.65,0; 2 0.65,-0.5; 3 0.65,0.5
SPARKFUN_0603-RES = smd 1.1 x 1: 1 -0.85,0; 2 0.85,0
1206 = smd 1.6 x 1.8: 1 -1.4,0; 2 1.4,0
R0805 = smd 1.3 x 1.5: 1 -0.95,0; 2 0.95,0
TACTILE_SWITCH_SMD = smd 1.524 x 0.762: 1 -2.54,1.905; 2 2.54,1.905; 3 -2.54,-1.905; 4 2.54,-1.905
BUZZER-CCV = smd 3.2 x 2.5: + 4,0; - -4,0 | hole 0.8: -3.9,-2.25; 2.25,3.9
MA06-1 = drill 1.016 long: 1 -6.35,0; 2 -3.81,0; 3 -1.27,0; 4 1.27,0; 5 3.81,0; 6 6.35,0
SO-24DW = smd 0.584 x 2.032: 1 -6.35,-5.08; 2 -5.08,-5.08; 3 -3.81,-5.08; 4 -2.54,-5.08; 5 -1.27,-5.08; 6 0,-5.08; 7 1.27,-5.08; 8 2.54,-5.08; 9 3.81,-5.08; 10 5.08,-5.08; 11 6.35,-5.08; 12 7.62,-5.08; 13 7.62,5.08; 14 6.35,5.08; 15 5.08,5.08; 16 3.81,5.08; 17 2.54,5.08; 18 1.27,5.08; 19 0,5.08; 20 -1.27,5.08; 21 -2.54,5.08; 22 -3.81,5.08; 23 -5.08,5.08; 24 -6.35,5.08
QFN32 = smd 0.3 x 0.6: 1 -1.75,-2.3; 2 -1.25,-2.3; 3 -0.75,-2.3; 4 -0.25,-2.3; 5 0.25,-2.3; 6 0.75,-2.3; 7 1.25,-2.3; 8 1.75,-2.3; 17 1.75,2.3; 18 1.25,2.3; 19 0.75,2.3; 20 0.25,2.3; 21 -0.25,2.3; 22 -0.75,2.3; 23 -1.25,2.3; 24 -1.75,2.3 | smd 0.6 x 0.3: 9 2.3,-1.75; 10 2.3,-1.25; 11 2.3,-0.75; 12 2.3,-0.25; 13 2.3,0.25; 14 2.3,0.75; 15 2.3,1.25; 16 2.3,1.75; 25 -2.3,1.75; 26 -2.3,1.25; 27 -2.3,0.75; 28 -2.3,0.25; 29 -2.3,-0.25; 30 -2.3,-0.75; 31 -2.3,-1.25; 32 -2.3,-1.75 | smd 3.2 x 3.2: EXP 0,0
LGA-14 = smd 0.6 x 0.9: 1 -2,-1; 2 -1.2,-1; 3 -0.4,-1; 4 0.4,-1; 5 1.2,-1; 6 2,-1; 8 2,1; 9 1.2,1; 10 0.4,1; 11 -0.4,1; 12 -1.2,1; 13 -2,1 | smd 0.9 x 0.6: 7 2,0; 14 -2,0
5032 = smd 2.286 x 2.032: 1 -2.413,0; 2 2.413,0

### Placement (x,y rotation side)
BAT1  14.1,38.61 305 bottom
BAT2  42.9,38.61 55 bottom
C1  43.74,33.19 0 top
C2  32.64,33.49 90 top
C3  31.57,29.77 90 bottom
IC1  39.42,24.89 270 top
LED1  54.45,28.45 90 top
LED2  54.31,31.17 96 top
LED3  53.88,33.85 102 top
LED4  53.18,36.48 108 top
LED5  52.2,39.02 114 top
LED6  50.96,41.45 120 top
LED7  49.48,43.73 126 top
LED8  47.77,45.85 132 top
LED9  45.85,47.77 138 top
LED10  43.73,49.48 144 top
LED11  41.45,50.96 150 top
LED12  39.02,52.2 156 top
LED13  36.48,53.18 162 top
LED14  33.85,53.88 168 top
LED15  30.78,54.41 174 top
LED16  28.45,54.45 180 top
LED17  25.73,54.31 186 top
LED18  23.04,53.88 192 top
LED19  20.41,53.18 198 top
LED20  17.87,52.2 204 top
LED21  15.45,50.96 210 top
LED22  13.17,49.48 216 top
LED23  11.05,47.77 222 top
LED24  9.13,45.85 228 top
LED25  7.41,43.73 234 top
LED26  5.93,41.45 240 top
LED27  4.7,39.02 246 top
LED28  3.72,36.48 252 top
LED29  3.02,33.85 258 top
LED30  2.59,31.17 264 top
LED31  2.45,28.45 270 top
LED32  2.59,25.73 276 top
LED33  3.02,23.04 282 top
LED34  3.72,20.41 288 top
LED35  4.7,17.87 294 top
LED36  5.93,15.45 300 top
LED37  7.41,13.17 306 top
LED38  9.13,11.05 312 top
LED39  11.05,9.13 318 top
LED40  13.17,7.41 324 top
LED41  15.45,5.93 330 top
LED42  17.87,4.7 336 top
LED43  20.41,3.72 342 top
LED44  23.04,3.02 348 top
LED45  25.73,2.59 354 top
LED46  28.45,2.45 0 top
LED47  31.17,2.59 6 top
LED48  33.85,3.02 12 top
LED49  36.48,3.72 18 top
LED50  39.02,4.7 24 top
LED51  41.45,5.93 30 top
LED52  43.73,7.41 36 top
LED53  45.85,9.13 42 top
LED54  47.77,11.05 48 top
LED55  49.48,13.17 54 top
LED56  50.96,15.45 60 top
LED57  52.2,17.87 66 top
LED58  53.18,20.41 72 top
LED59  53.88,23.04 78 top
LED60  54.31,25.73 84 top
LED61  51.31,28.45 90 top
LED62  48.24,39.88 120 top
LED63  48.24,17.02 240 top
LED64  28.45,51.31 180 top
LED65  39.88,48.24 330 top
LED66  8.87,39.88 60 top
LED67  17.02,48.24 30 top
LED68  5.59,28.45 90 top
LED69  8.65,17.02 120 top
LED70  17.02,8.65 150 top
LED71  28.45,5.59 180 top
LED72  40.07,8.65 210 top
Q1  49.49,31.55 199 top
Q2  37.54,44.85 250 top
Q3  20.63,46.12 290 top
Q4  11.29,43.84 319 top
Q5  7.49,32.94 10 top
Q6  13.6,14.47 50 top
Q7  24.97,6.05 77 top
Q8  41.87,12.21 130 top
Q9  38.51,12.16 170 top
R1  47.66,35.15 280 top
R2  35.52,42.15 50 top
R3  21.31,42.95 104 top
R4  13.88,40.73 130 top
R5  7.87,29.94 90 top
R6  16.95,16.84 180 top
R7  24.66,8.82 340 top
R8  40.08,14.59 290 top
R9  15.69,21.11 270 top
R10  34.16,18.21 0 bottom
R11  33.09,28.45 270 top
S2  28.6,39.42 0 top
SG1  28.45,13.21 270 bottom
SV1  28.45,13.46 0 top
U2  17.02,32.13 270 top
U$1  28.8,23.37 180 top
U$5  28.52,28.45 270 bottom
X1  38.26,33.42 0 top

### Tracks (layer width: path | path; a pad name or v marks a point on that pad's centre or on a via)
!CS  (1 unrouted)
COL1  (2 unrouted)
  Top 0.254: LED8.P$1 48.35,45.3 49.95,43.1 | 51.31,40.77 49.95,43.1 | 52.52,38.38 51.31,40.77 | 53.41,35.69 52.52,38.38 | 54,33.13 53.41,35.69 | 54.42,30.35 54,33.13 | 54.42,30.35 54.48,27.72 LED1.P$1 | LED2.P$1 54.42,30.35 | 54,33.13 LED3.P$1 | 53.41,35.69 LED4.P$1 | 52.52,38.38 LED5.P$1 | 51.31,40.77 LED6.P$1 | 49.95,43.1 LED7.P$1
COL2  (via drill 0.36)  (2 unrouted)
  Top 0.254: LED1.P$2 v56,28.38 | v49.12,46.63 LED8.P$2 | v50.76,44.51 LED7.P$2 | v52.34,42.21 LED6.P$2 | v53.65,39.59 LED5.P$2 | v54.62,36.9 LED4.P$2 | v55.43,34.25 LED3.P$2 | v55.94,31.28 LED2.P$2
  Bottom 0.254: v56,28.38 v55.94,31.28 v55.43,34.25 v54.62,36.9 v53.65,39.59 v52.34,42.21 v50.76,44.51 v49.12,46.63
COL3  (2 unrouted)
  Top 0.254: 49.02,48.13 LED8.P$3 49,48.01 50.92,45.51 | 50.92,45.51 LED7.P$3 51.15,45.52 52.7,43.18 LED6.P$3 52.46,43.06 53.98,40.64 LED5.P$3 54.06,40.61 55.12,37.85 | 50.92,45.51 51.05,45.59 | 55.12,37.85 LED4.P$3 | 56.46,32.12 LED2.P$3 56.64,32.13 | 56.46,32.12 56.64,32.13 | 55.12,37.85 55.86,35.17 LED3.P$3 55.88,35.18 56.64,32.13 | LED1.P$3 56.9,29.21 56.46,32.12
COL4  (2 unrouted)
  Top 0.254: 34.72,53.85 LED14.P$1 | 34.72,53.85 34.29,53.85 31.55,54.3 | LED16.P$1 29.2,54.54 31.55,54.3 | 34.72,53.85 34.67,53.74 37.15,52.95 | 37.15,52.95 39.72,51.9 | 39.72,51.9 42.17,50.6 | 42.17,50.6 44.42,49.01 | 44.42,49.01 46.46,47.16 LED9.P$1 | 31.55,54.3 LED15.P$1 | 37.15,52.95 LED13.P$1 | 39.72,51.9 LED12.P$1 | 42.17,50.6 LED11.P$1 | 44.42,49.01 LED10.P$1
COL5  (via drill 0.36)  (2 unrouted)
  Top 0.254: LED16.P$2 v28.47,56.01 | v47,49.16 LED9.P$2 | v44.77,50.92 LED10.P$2 | v42.38,52.44 LED11.P$2 | v39.84,53.72 LED12.P$2 | v37.11,54.77 LED13.P$2 | v34.22,55.43 LED14.P$2 | v31.08,56 LED15.P$2
  Bottom 0.254: v28.47,56.01 v31.08,56 v34.22,55.43 v37.11,54.77 v39.84,53.72 v42.38,52.44 v44.77,50.92 v47,49.16
COL6  (2 unrouted)
  Top 0.254: 27.69,56.77 LED16.P$3 27.74,56.79 30.35,56.64 LED15.P$3 30.39,56.59 33.53,56.26 LED14.P$3 33.65,56.16 36.52,55.47 | 36.52,55.47 LED13.P$3 36.54,55.58 39.24,54.61 LED12.P$3 39.23,54.63 41.91,53.34 LED11.P$3 42.02,53.37 44.45,51.82 LED10.P$3 44.53,51.78 46.86,50.16 LED9.P$3 | 36.52,55.47 36.58,55.63
COL7  (1 unrouted)
  Top 0.254: 14.3,50.34 13.7,50.01 LED22.P$1 13.72,50.02 12.57,49.06 11.56,48.19 LED23.P$1 11.58,48.16 10.47,47.21 9.73,46.42 LED24.P$1 | 14.3,50.34 15.44,50.97 16.05,51.3 LED21.P$1 16.05,51.31 17.88,52.17 18.57,52.48 LED20.P$1 18.61,52.52 20.47,53.18 21.19,53.46 LED19.P$1 21.21,53.42 23.09,53.89 23.72,54.02 LED18.P$1 23.76,54.05 26.47,54.39 LED17.P$1 | LED67.P$1 15.69,47.31 15.49,47.5 15.11,48.39 15.11,49.15 14.3,50.34 | U$1.9 25.43,25.12 24.64,25.91
COL8  (via drill 0.36)  (2 unrouted)
  Top 0.254: LED20.P$2 17.36,53.42 v17.95,53.82 | v20.19,54.76 LED19.P$2 | v22.93,55.57 LED18.P$2 | v25.79,55.96 LED17.P$2 | v14.81,52.19 LED21.P$2 | v12.29,50.68 LED22.P$2 | v10.03,48.91 LED23.P$2 | LED24.P$2 v8.01,46.85
  Bottom 0.254: v20.19,54.76 19.98,54.7 v17.95,53.82 v14.81,52.19 v12.29,50.68 v10.03,48.91 v8.01,46.85 | v20.19,54.76 v22.93,55.57 v25.79,55.96 | v20.19,54.76 19.7,54.58
COL9  (2 unrouted)
  Top 0.254: LED24.P$3 6.98,46.74 6.98,46.86 9.02,48.89 | 9.02,48.89 9.02,48.79 LED23.P$3 | LED20.P$3 16.26,53.85 | 19.05,54.99 LED19.P$3 19.05,54.98 | 21.72,55.88 LED18.P$3 | 24.77,56.52 LED17.P$3 24.73,56.47 21.72,55.88 | 9.02,48.89 11.16,50.89 LED22.P$3 11.18,50.93 13.72,52.56 13.75,52.58 LED21.P$3 13.72,52.58 16.24,53.83 LED20.P$3 | 19.05,54.98 21.72,55.88 | LED20.P$3 16.26,53.85 19.05,54.98
COL10  (via drill 0.36)  (1 unrouted)
  Top 0.254: LED25.P$1 7.8,44.34 6.34,42.09 | 6.34,42.09 LED26.P$1 | 4.88,39.77 4.94,39.74 6.34,42.09 | 4.88,39.77 LED27.P$1 | 3.88,37.16 LED28.P$1 | 4.88,39.77 3.88,37.16 | 3.88,37.16 3.12,34.52 | 3.12,34.52 LED29.P$1 | 2.62,31.9 LED30.P$1 | 3.12,34.52 2.62,31.9 | 2.62,31.9 2.52,29.17 | 2.52,29.17 LED31.P$1 | 2.52,29.17 2.52,26.46 LED32.P$1 | U$1.12 23.75,23.62 23.5,23.88 23.24,23.62 v18.54,23.62 | v6.48,23.75 LED68.P$1
  Bottom 0.254: v18.54,23.62 arc25 12.7,22.35 7.87,22.35 v6.48,23.75
COL11  (via drill 0.36)  (2 unrouted)
  Top 0.254: v2.4,36.93 LED28.P$2 | v0.86,28.39 LED31.P$2 | LED25.P$2 v6.06,44.7 | v4.6,42.31 LED26.P$2 | v3.29,39.7 LED27.P$2 | v1.46,34.2 LED29.P$2 | v0.88,31.26 LED30.P$2 | v1.05,25.55 LED32.P$2 | U$1.11 24.27,24.12 23.88,24.51
  Bottom 0.254: v6.06,44.7 v4.6,42.31 v3.29,39.7 v2.4,36.93 v1.46,34.2 v0.88,31.26 v0.86,28.39 v1.05,25.55
COL12  (2 unrouted)
  Top 0.254: 0.38,24.77 LED32.P$3 0.39,24.81 0.25,27.69 LED31.P$3 0.24,27.64 0.13,30.61 LED30.P$3 -0.05,30.52 0.76,33.53 LED29.P$3 0.75,33.59 1.4,36.45 1.56,36.4 | 1.56,36.4 LED28.P$3 | 2.41,39.24 LED27.P$3 | 3.68,41.91 LED26.P$3 | 3.68,41.91 2.41,39.24 | 2.41,39.24 1.56,36.4 | LED25.P$3 5.05,44.51 3.68,41.91 | U$1.10 24.66,24.62 24.64,24.64
COL13  (via drill 0.36)  (1 unrouted)
  Top 0.254: LED33.P$1 2.84,23.73 3.55,21.07 | 3.55,21.07 LED34.P$1 | 3.55,21.07 4.42,18.45 | 4.42,18.45 LED35.P$1 | 5.58,16.13 LED36.P$1 | 4.42,18.45 5.58,16.13 | 6.92,13.67 LED37.P$1 | 5.58,16.13 6.92,13.67 | 6.92,13.67 8.51,11.68 8.51,11.56 LED38.P$1 8.59,11.59 10.41,9.58 LED39.P$1 10.47,9.56 12.64,7.82 LED40.P$1 12.58,7.74 | U$1.15 23.52,22.12 22.99,21.59 v18.67,18.54 | v14.61,18.16 LED69.P$1
  Bottom 0.254: v18.67,18.54 v14.61,18.16
COL14  (via drill 0.36)  (1 unrouted)
  Top 0.254: LED33.P$2 v1.34,22.84 | v12.23,6.04 LED40.P$2 | v9.99,8.02 LED39.P$2 | v7.86,9.94 LED38.P$2 | v6.08,12.21 LED37.P$2 | v4.36,14.64 LED36.P$2 | v3.17,17.26 LED35.P$2 | v2.16,19.94 LED34.P$2 | U$1.14 23,22.62 22.61,22.23 v18.8,20.45 | v14.35,19.18 LED69.P$2
  Bottom 0.254: v1.34,22.84 v2.16,19.94 v3.17,17.26 v4.36,14.64 v6.08,12.21 v7.86,9.94 v9.99,8.02 v12.23,6.04 | v18.8,20.45 v14.35,19.18
COL15  (via drill 0.36)  (2 unrouted)
  Top 0.254: LED40.P$3 12.45,5.21 10.08,7.06 10.13,7.11 LED39.P$3 10.12,7.19 | 10.12,7.19 10.03,7.11 | LED38.P$3 7.87,9.02 | 4.53,13.65 LED36.P$3 | 4.53,13.65 4.45,13.59 | 2.92,16.26 LED35.P$3 2.91,16.24 1.88,19.11 | LED34.P$3 1.88,19.11 | 1.88,19.11 1.65,19.05 | 1.02,21.84 LED33.P$3 1.04,21.79 1.88,19.11 | LED38.P$3 7.88,8.99 6.22,11.05 LED37.P$3 6.19,10.98 4.53,13.65 | LED38.P$3 7.96,8.99 10.12,7.19 | U$1.13 22.61,23.12 22.48,22.99 v19.18,22.48 | v13.21,19.69 LED69.P$3
  Bottom 0.254: v19.18,22.48 v13.21,19.69
COL16  (via drill 0.36)  (1 unrouted)
  Top 0.254: LED41.P$1 14.84,6.3 16.7,5.25 17.13,4.99 LED42.P$1 17.15,5.03 19.75,3.95 | 22.36,3.11 19.75,3.95 | 24.99,2.64 22.36,3.11 | 27.7,2.36 24.99,2.64 | 30.35,2.42 27.7,2.36 | 30.35,2.42 33.16,2.84 LED48.P$1 | 19.75,3.95 LED43.P$1 | 22.36,3.11 LED44.P$1 | 24.99,2.64 LED45.P$1 | 27.7,2.36 LED46.P$1 | 30.35,2.42 LED47.P$1 | U$1.18 27.55,20.19 27.3,19.94 24.64,19.94 24.38,19.69 v20.45,15.11 | v18.92,10.41 LED70.P$1
  Bottom 0.254: v20.45,15.11 v18.92,10.41
COL17  (via drill 0.36)  (1 unrouted)
  Top 0.254: v14.68,4.58 LED41.P$2 | LED48.P$2 v34.17,1.27 | v31.23,0.79 LED47.P$2 | v28.42,0.53 LED46.P$2 | v25.58,0.79 LED45.P$2 | v22.66,1.34 LED44.P$2 | v19.95,2.23 LED43.P$2 | v17.25,3.31 LED42.P$2 | U$1.17 24.88,21.07 23.75,19.94 v19.56,15.49 | v18.16,12.07 LED70.P$2
  Bottom 0.254: v14.68,4.58 v17.25,3.31 v19.95,2.23 v22.66,1.34 v25.58,0.79 v28.42,0.53 v31.23,0.79 v34.17,1.27 | v19.56,15.49 v18.16,12.07
COL18  (via drill 0.36)  (1 unrouted)
  Top 0.254: LED48.P$3 35.05,0.76 32.11,0.35 32.02,0.38 LED47.P$3 32,0.25 29.14,0.04 LED46.P$3 29.21,0 26.19,0.07 LED45.P$3 26.19,0.19 | 26.19,0.19 26.16,0 | 14.99,3.56 LED41.P$3 15.04,3.63 17.65,2.41 LED42.P$3 17.69,2.46 20.45,1.27 LED43.P$3 20.46,1.29 23.37,0.64 LED44.P$3 23.27,0.58 26.19,0.19 | U$1.16 24.03,21.62 23.37,20.95 v19.56,17.02 | v17.14,13.21 LED70.P$3
  Bottom 0.254: v19.56,17.02 v17.14,13.21
COL19  (1 unrouted)
  Top 0.254: LED49.P$1 35.71,3.49 38.38,4.34 | 40.75,5.57 38.38,4.34 | 43.24,7.01 40.75,5.57 | 45.33,8.67 43.24,7.01 | 47.27,10.52 45.33,8.67 | 47.27,10.52 49.05,12.59 | 49.05,12.59 50.52,14.85 LED56.P$1 | 49.05,12.59 LED55.P$1 | LED54.P$1 47.27,10.52 | 45.33,8.67 LED53.P$1 | 43.24,7.01 LED52.P$1 | 40.75,5.57 LED51.P$1 | 38.38,4.34 LED50.P$1 | U$1.21 29.05,18.95 29.21,18.8 29.21,6.25 LED71.P$1
COL20  (via drill 0.36)
  Top 0.254: v36.99,2 LED49.P$2 v37.08,2.03 | v52.65,14.52 LED56.P$2 | v39.92,3.01 LED50.P$2 | v42.38,4.39 LED51.P$2 | v44.78,5.93 LED52.P$2 | v47.02,7.79 LED53.P$2 | LED54.P$2 v49.17,9.87 | v51.02,12.07 LED55.P$2 | U$1.20 28.55,18.94 28.7,18.8 28.7,7.37 28.45,7.11 28.45,6.98 | 28.45,6.98 LED71.P$2 | v27.81,6.98 28.45,6.98
  Bottom 0.254: v36.99,2 v39.92,3.01 v42.38,4.39 v44.78,5.93 v47.02,7.79 v49.17,9.87 v51.02,12.07 v52.65,14.52 | v37.08,2.03 35.81,5.97 v27.81,6.98
COL21  (1 unrouted)
  Top 0.254: 53.34,14.99 LED56.P$3 53.41,14.96 51.53,12.56 | 51.53,12.56 LED55.P$3 51.68,12.52 50.04,10.03 LED54.P$3 49.99,10.09 48.01,7.75 LED53.P$3 47.95,7.68 45.74,5.98 | 51.53,12.56 51.69,12.45 | 45.74,5.98 LED52.P$3 45.78,5.88 43.31,4.19 | 45.74,5.98 45.85,5.84 | 43.31,4.19 LED51.P$3 | 43.31,4.19 40.89,2.92 LED50.P$3 41.03,2.84 38.26,1.63 LED49.P$3 | U$1.19 28.05,19.19 28.07,19.18 27.18,18.29 27.18,6.76 arc90 LED71.P$3
COL22  (6 unrouted)
  Top 0.254: LED57.P$1 51.92,17.2 52.91,19.69 | 52.91,19.69 53.72,22.28 | 53.72,22.28 54.2,25 LED60.P$1 | 52.91,19.69 LED58.P$1 | 53.72,22.28 LED59.P$1
COL23  (via drill 0.36)  (6 unrouted)
  Top 0.254: LED57.P$2 v53.63,17.18 | v56.1,25.46 LED60.P$2 | v55.51,22.73 LED59.P$2 | v54.72,19.8 LED58.P$2
  Bottom 0.254: v53.63,17.18 v54.72,19.8 v55.51,22.73 v56.1,25.46
COL24  (5 unrouted)
  Top 0.254: 56.64,26.3 LED60.P$3 | 56.64,26.3 56.9,26.29 | 56.21,23.28 LED59.P$3 56.25,23.29 56.64,26.3 | 56.21,23.28 56.39,23.24 | 54.61,17.53 LED57.P$3 54.61,17.61 55.5,20.32 LED58.P$3 55.44,20.28 56.21,23.28 | U$1.22 29.55,19.21 29.97,18.8 34.8,17.02 36.32,14.48 37.21,9.02 LED72.P$3
FLAVAFLAV  (via drill 3.17 pad 6.35)
  other vias: 28.45,46.05
GND
  pour Top: -0.76,29.84 arc89 28.56,-0.13 arc91 57.66,28.34 57.66,28.46 arc89 29.74,56.99 27.05,57.05 arc91
  pour Bottom: 57.66,27.78 arc89 29.06,57.01 arc91 -0.76,27.83 arc89 26.56,-0.09 29.12,-0.14 arc91
INT1/DRDY  (1 unrouted)
INT2  (1 unrouted)
LINE1  (via drill 0.36)  (7 unrouted)
  Top 0.254: LED49.P$4 LED49.P$5 arc30 LED49.P$6 | LED41.P$4 LED41.P$5 arc30 LED41.P$6 | LED33.P$4 LED33.P$5 LED33.P$6 | LED25.P$4 LED25.P$5 arc30 LED25.P$6 | LED17.P$4 LED17.P$5 LED17.P$6 | LED9.P$4 LED9.P$5 LED9.P$6 v43.69,44.96 | LED1.P$4 LED1.P$5 LED1.P$6 | LED57.P$6 LED57.P$5 LED57.P$4 v51.05,19.05 | Q1.1 v48.77,38.61
  Bottom 0.254: v51.05,19.05 52.58,25.78 | v48.77,38.61 v43.69,44.96
LINE2  (via drill 0.36)  (6 unrouted)
  Top 0.254: LED50.P$6 arc-30 LED50.P$5 LED50.P$4 v38.86,6.6 | LED42.P$4 LED42.P$5 arc30 LED42.P$6 | LED34.P$6 LED34.P$5 arc-30 LED34.P$4 | LED26.P$4 LED26.P$5 arc30 LED26.P$6 | LED18.P$4 LED18.P$5 LED18.P$6 | LED10.P$4 LED10.P$5 LED10.P$6 v42.93,47.24 | LED58.P$4 LED58.P$5 LED58.P$6 52.11,19.69 v52.07,19.69 | LED2.P$6 LED2.P$5 LED2.P$4 51.56,32.51 51.31,35.05 v51.69,36.2
  Bottom 0.254: v52.07,19.69 52.83,16.38 51.05,13.46 47.62,9.78 44.83,7.87 40.51,4.32 v38.86,6.6 | v51.69,36.2 v42.93,47.24
LINE3  (via drill 0.36)  (5 unrouted)
  Top 0.254: LED51.P$6 LED51.P$5 LED51.P$4 | LED43.P$4 LED43.P$5 arc30 LED43.P$6 | LED35.P$4 LED35.P$5 arc30 LED35.P$6 | LED27.P$4 LED27.P$5 arc30 LED27.P$6 5.46,38.73 v5.97,38.48 | LED19.P$6 LED19.P$5 LED19.P$4 v19.69,51.44 | LED11.P$4 LED11.P$5 LED11.P$6 v41.53,48.64 | LED3.P$5 LED3.P$4 v52.58,33.53 | LED3.P$5 LED3.P$6 | LED59.P$6 LED59.P$5 LED59.P$4 v53.09,24.51 | v52.2,33.15 LED3.P$5
  Bottom 0.254: v5.97,38.48 4.32,39.12 5.46,41.78 7.11,44.2 8.64,46.1 10.67,48.26 13.08,49.91 15.37,51.56 v19.69,51.44 | v53.09,24.51 54.74,26.92 55.37,29.21 54.99,33.4 v52.2,33.15 | v52.58,33.53 53.59,36.83 51.18,42.29 49.53,44.7 45.09,49.15 42.67,51.18 v41.53,48.64
LINE4  (via drill 0.36)  (4 unrouted)
  Top 0.254: LED44.P$6 arc-30 LED44.P$5 LED44.P$4 v24.13,4.32 | LED36.P$4 LED36.P$5 arc30 LED36.P$6 | LED28.P$4 LED28.P$5 arc30 LED28.P$6 4.45,36.07 4.83,36.2 v4.95,36.07 | LED20.P$4 LED20.P$5 LED20.P$6 | LED12.P$4 LED12.P$5 LED12.P$6 v38.61,50.04 | LED60.P$6 LED60.P$5 LED60.P$4 v53.85,26.8 | LED52.P$4 LED52.P$5 LED52.P$6 v42.16,8.13 | Q4.1 v10.29,44.7 | v51.94,34.92 LED4.P$6 LED4.P$5 LED4.P$4 51.65,37 v51.31,37.34
  Bottom 0.254: v4.95,36.07 7.11,38.48 5.71,40.01 9.4,45.59 v10.29,44.7 | v53.85,26.8 52.83,27.69 51.18,34.16 v51.94,34.92 | v51.31,37.34 43.69,48.77 v38.61,50.04 | v24.13,4.32 23.75,2.16 25.65,1.91 31.24,1.78 33.91,2.29 v42.16,8.13
LINE5  (9 unrouted)
  Top 0.254: LED45.P$4 LED45.P$5 arc30 LED45.P$6 | LED37.P$4 LED37.P$5 arc30 LED37.P$6 | LED29.P$6 arc-30 LED29.P$5 LED29.P$4 Q5.1 | LED21.P$4 LED21.P$5 LED21.P$6 | LED13.P$4 LED13.P$5 LED13.P$6 | LED5.P$4 LED5.P$5 LED5.P$6 | LED53.P$4 LED53.P$5 LED53.P$6
LINE6  (10 unrouted)
  Top 0.254: LED46.P$4 LED46.P$5 arc30 LED46.P$6 | LED38.P$4 LED38.P$5 arc30 LED38.P$6 | LED30.P$4 LED30.P$5 arc30 LED30.P$6 | LED22.P$4 LED22.P$5 LED22.P$6 | LED14.P$4 LED14.P$5 LED14.P$6 | LED6.P$4 LED6.P$5 LED6.P$6 | LED54.P$4 LED54.P$5 LED54.P$6
LINE7  (10 unrouted)
  Top 0.254: LED47.P$4 LED47.P$5 arc30 LED47.P$6 | LED39.P$4 arc67 11.94,9.4 LED39.P$5 arc4 LED39.P$6 | LED31.P$4 LED31.P$5 LED31.P$6 | LED23.P$4 LED23.P$5 LED23.P$6 | LED15.P$4 LED15.P$5 LED15.P$6 | LED7.P$4 LED7.P$5 LED7.P$6 | LED55.P$6 LED55.P$5 LED55.P$4 49.02,14.53 49.02,15.49 49.18,15.65
LINE8  (10 unrouted)
  Top 0.254: LED40.P$4 LED40.P$5 arc30 LED40.P$6 | LED32.P$4 LED32.P$5 LED32.P$6 | LED24.P$4 LED24.P$5 LED24.P$6 | LED16.P$4 LED16.P$5 LED16.P$6 | LED8.P$4 LED8.P$5 LED8.P$6 | LED56.P$4 LED56.P$5 LED56.P$6 | LED64.P$4 LED64.P$5 LED64.P$6
LINE9  (16 unrouted)
  Top 0.254: LED68.P$6 LED68.P$5 LED68.P$4 | LED66.P$4 LED66.P$5 LED66.P$6 | LED67.P$4 LED67.P$5 LED67.P$6 | LED65.P$4 LED65.P$5 | LED72.P$6 41.4,8.82 41.4,9.65 39.15,11.9 Q9.1
MISO  (1 unrouted)
MOSI  (1 unrouted)
N$2  (1 unrouted)
N$5  (1 unrouted)
N$7
  Top 0.254: IC1.7 37.47,30.61 X1.2 41.15,33.27 C1.1
N$8
  Top 0.254: IC1.8 X1.1 35.81,33.27 C2.1
N$9  (via drill 0.36)
  Top 0.254: U$1.26 32.79,22.12 v32.89,22.23 | v41.15,22.1 41.42,21.83 IC1.23
  Bottom 0.254: v32.89,22.23 41.02,22.23 v41.15,22.1
N$10  (via drill 0.36)
  Top 0.254: IC1.24 42.16,20.65 42.16,22.86 41.78,23.24 v41.66,23.24 | v32.64,23.75 32.27,24.12 U$1.30
  Bottom 0.254: v41.66,23.24 41.15,23.75 v32.64,23.75
N$11  (via drill 0.36)
  Top 0.254: U$1.31 32.87,24.62 arc90 v32.89,24.64 | v43.69,20.83 IC1.25
  Bottom 0.254: v32.89,24.64 41.15,24.64 IC1.25 v43.69,20.83
N$12  (via drill 0.36)
  Top 0.254: U$1.32 31.62,25.4 v33.27,25.4 | v45.47,22.86 IC1.26
  Bottom 0.254: v33.27,25.4 41.78,25.4 v45.47,22.86
N$13  (1 unrouted)
N$34
  Top 0.254: R2.2 Q2.2
N$59  (1 unrouted)
N$60  (1 unrouted)
N$61  (1 unrouted)
N$62  (1 unrouted)
N$63
  Top 0.254: Q5.2 R5.2
N$84  (1 unrouted)
N$89  (1 unrouted)
PD2  (1 unrouted)
PD3  (1 unrouted)
  Top 0.254: IC1.1 42.16,29.12 42.16,27.05
PD4  (1 unrouted)
PD5  (1 unrouted)
PD6  (1 unrouted)
PD7  (1 unrouted)
ROW1  (1 unrouted)
ROW2  (1 unrouted)
ROW3  (1 unrouted)
ROW4  (1 unrouted)
ROW5
  Top 0.254: U2.5 9.4,33.4 9.27,29.59 R5.1
ROW6
  Top 0.254: U2.6 12.07,32.26 15.75,32.26 17.6,30.41 R6.1
ROW7
  Top 0.203: 17.02,29.72 17.02,15.75
  Top 0.254: U2.7 12.07,30.99 15.75,30.99 17.02,29.72 | 17.02,15.75 23.66,9.11 R7.1
ROW8  (via drill 0.36)
  Top 0.254: v15.62,29.59 U2.8 | v34.04,20.32 38.97,15.39 R8.1
  Bottom 0.254: v15.62,29.59 24.89,20.32 v34.04,20.32
ROW9
  Top 0.254: R9.1 15.75,27.18 14.61,28.32 U2.9
RST  (via drill 0.36)
  Top 0.254: IC1.29 44.83,25.27 v45.59,25.27
  Bottom 0.254: v45.59,25.27 46.36,22.61 43.81,19.56 37.21,16.64 33.27,16.76 32.26,15.75 SV1.5
SCK  (1 unrouted)
SCL/SPC  (1 unrouted)
SDA/SDI/SDO  (1 unrouted)
SDO  (1 unrouted)
VCC  (21 unrouted)